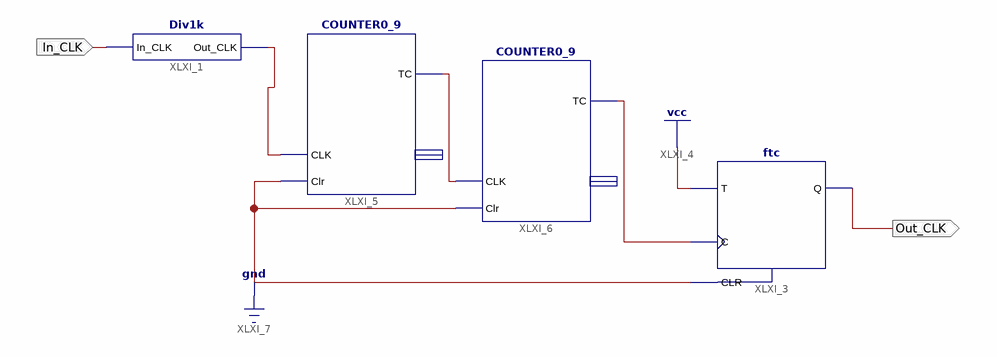
[diagram p0: schematic sheet 1]
// Xilinx ISE schematic Div1M.sch (spartan6) as structural Verilog: 4 symbols, 2 ports
module Div1M (
  input  In_CLK,
  output Out_CLK
);

  wire XLXN_2, XLXN_24, XLXN_25;

  Div1k XLXI_1 (.In_CLK(In_CLK), .Out_CLK(XLXN_24));
  COUNTER0_9 XLXI_5 (.CLK(XLXN_24), .Clr(1'b0), .TC(XLXN_25));  // open: bit
  COUNTER0_9 XLXI_6 (.CLK(XLXN_25), .Clr(1'b0), .TC(XLXN_2));  // open: bit
  ftc XLXI_3 (.C(XLXN_2), .CLR(1'b0), .T(1'b1), .Q(Out_CLK));
endmodule
